# Altium project 2HE2E_Tester.PrjPcb (part 2 of 2)

## Sheet BatteryEmulator.SchDoc
size A4; SheetNumber: 12; SheetTotal: 13
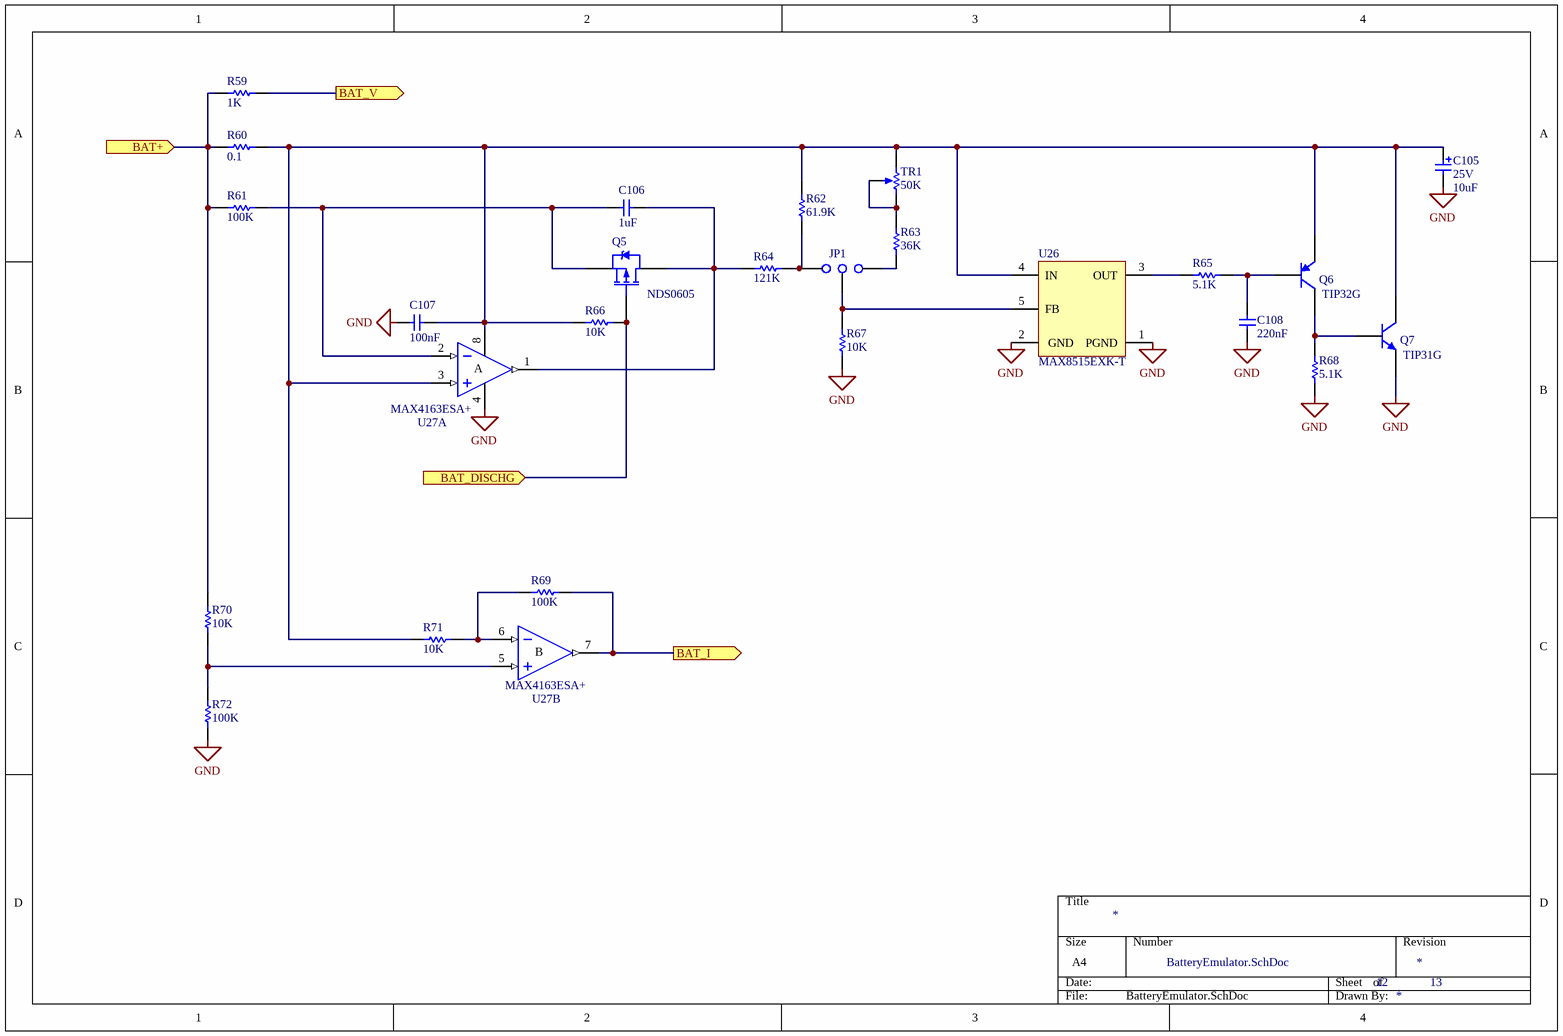
[diagram p12: BatteryEmulator.SchDoc]

### Parts
C105  25V  value 10uF  [Cap Elet SMD 6.3 mm CASE D]
C106  value 1uF  [Cap Polyester 5 mm]  (hidden comment: Cap Polyester)
C107  value 100nF  [0603M-C]  (hidden comment: Cap Ceramic)
C108  value 220nF  [0603M-C]  (hidden comment: Cap Ceramic)
JP1  Jumper 3 pin  [HEADER3]  (value not drawn)
Q5  NDS0605  [SOT23 PMV65XP MOS]
Q6  TIP32G  [TO220_BJT]
Q7  TIP31G  [TO220_BJT]
R59  value 1K  [0603M]  (hidden comment: Resistor)
R60  value 0.1  [1206M]  (hidden comment: Resistor)
R61  value 100K  [0603M]  (hidden comment: Resistor)
R62  value 61.9K  [0603M]  (hidden comment: Resistor)
R63  value 36K  [0603M]  (hidden comment: Resistor)
R64  value 121K  [0603M]  (hidden comment: Resistor)
R65  value 5.1K  [0603M]  (hidden comment: Resistor)
R66  value 10K  [0603M]  (hidden comment: Resistor)
R67  value 10K  [0603M]  (hidden comment: Resistor)
R68  value 5.1K  [0603M]  (hidden comment: Resistor)
R69  value 100K  [0603M]  (hidden comment: Resistor)
R70  value 10K  [0603M]  (hidden comment: Resistor)
R71  value 10K  [0603M]  (hidden comment: Resistor)
R72  value 100K  [0603M]  (hidden comment: Resistor)
TR1  value 50K  [TRIMMER 3296W]  (hidden comment: Giri)
U26  MAX8515EXK-T  [SC70-SOT65P210X110-5N]
U27  MAX4163ESA+  [SOIC127P600-8N]  (parts A,B of 2)

### Ports
BAT+ (in, see 2HE2E_Tester), BAT_DISCHG (in, see 2HE2E_Tester), BAT_I (out, see 2HE2E_Tester), BAT_V (out, see 2HE2E_Tester)

### Nets
GND: C105.2 C107.1 C108.1 Q7.3(E) R67.1 R68.2 R72.1 U26.1(PGND) U26.2(GND) U27.4(V-)
BAT_EMU_DIS: Q5.1(G) R66.2 ; port BAT_DISCHG
BAT_EMU_I: R69.2 U27.7(OUT) ; port BAT_I
BAT_EMU_V: R59.2 ; port BAT_V
NetC105_1: C105.1 C107.2 Q6.3(E) Q7.1(C) R60.2 R62.2 R66.1 R71.1 TR1.1(TOP) U26.4(IN) U27.3(IN+) U27.8(V+)
NetC106_1: C106.1 Q5.3(S) R61.2 U27.2(IN-)
NetC106_2: C106.2 Q5.2(D) R64.1 U27.1(OUT)
NetC108_2: C108.2 Q6.2(B) R65.1
NetJP1_1: JP1.1 R62.1 R64.2
NetJP1_2: JP1.2 R67.2 U26.5(FB)
NetJP1_3: JP1.3 R63.1
NetK1_12: R59.1 R60.1 R61.1 R70.2 ; port BAT+
NetQ6_1: Q6.1(C) Q7.2(B) R68.1
NetR63_2: R63.2 TR1.2(BOT) TR1.3(TAP)
NetR65_2: R65.2 U26.3(OUT)
NetR69_1: R69.1 R71.2 U27.6(IN-)
NetR70_1: R70.1 R72.2 U27.5(IN+)

### Notes on the sheet
- Title
- Size:
- Date:
- A4
- Number:
- Time:
- Revision:
- Sheet
- of
- File:
- (in symbol MAX4163, part A) A
- (in symbol MAX4163, part B) B

### Library data of the parts
C105 = Cap Elettrolitico: Condensatore elettrolitico
C106 = Cap Polyester: Polyester Capacitor
C107 C108 = Cap Ceramic: Ceramic Capacitor
JP1 = Jumper3
Q5 = Transistor PMOS Enhancement: Mosfet canale P Enhancement
Q6 = Transistor PNP: PNP Bipolar Transistor; Published: 8-Jun-2000; LatestRevisionDate: 17-Jul-2002; LatestRevisionNote: Re-released for DXP Platform.; PackageReference: SOT-23B; Publisher: Altium Limited; Code_JEDEC: SOT-23
Q7 = Transistor NPN: NPN Bipolar Transistor
TR1 = Trimmer
U26 = MAX8515: Wide-Input 0.6V Shunt Regulators for Isolated DC-to-DC Converters
U27 = MAX4163: Op Amps UCSP, Micropower, Single-Supply, 10V, Rail-to-Rail I/O

## Sheet BatteryMonitor.SchDoc
size A4; SheetNumber: 13; SheetTotal: 13
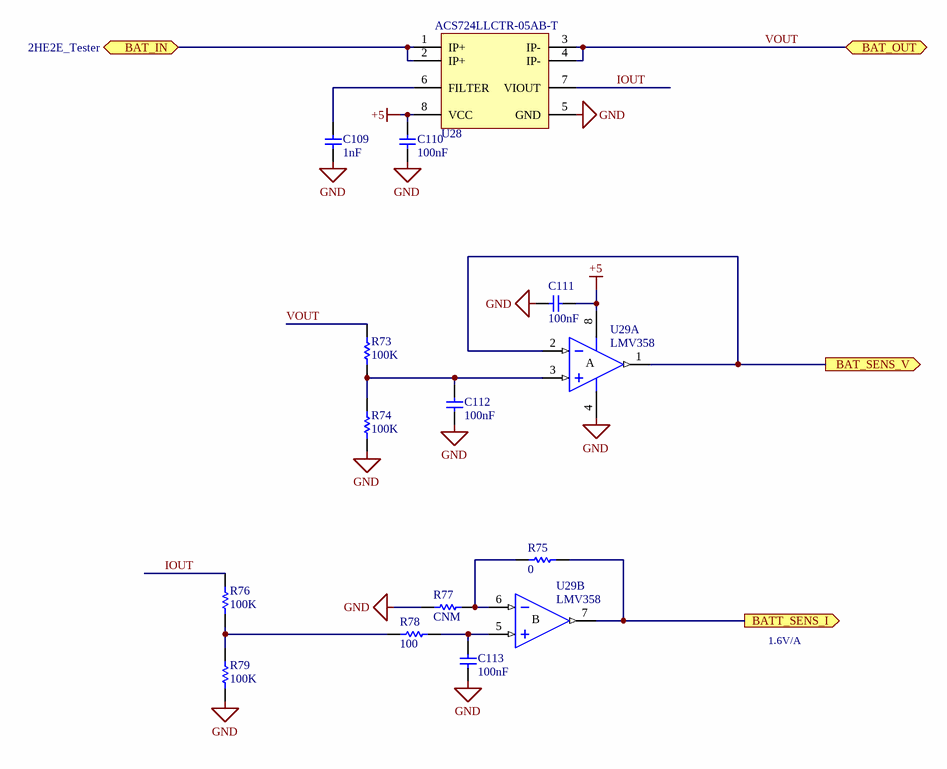
[diagram p13: BatteryMonitor.SchDoc]

### Parts
C109  value 1nF  [0603M]  (hidden comment: Cap Ceramic)
C110  value 100nF  [0603M]  (hidden comment: Cap Ceramic)
C111  value 100nF  [0603M]  (hidden comment: Cap Ceramic)
C112  value 100nF  [0603M]  (hidden comment: Cap Ceramic)
C113  value 100nF  [0603M]  (hidden comment: Cap Ceramic)
R73  value 100K  [0603M]  (hidden comment: Resistor)
R74  value 100K  [0603M]  (hidden comment: Resistor)
R75  value 0  [0603M]  (hidden comment: Resistor)
R76  value 100K  [0603M]  (hidden comment: Resistor)
R77  value CNM  [0603M]  (hidden comment: Resistor)
R78  value 100  [0603M]  (hidden comment: Resistor)
R79  value 100K  [0603M]  (hidden comment: Resistor)
U28  ACS724LLCTR-05AB-T  [SOIC127P600-8N]
U29  LMV358  [SOIC127P600-8N]  (parts A,B of 2)

### Ports
BAT_IN (bidir, see 2HE2E_Tester), BAT_OUT (bidir, see 2HE2E_Tester), BAT_SENS_V (out, see 2HE2E_Tester), BATT_SENS_I (out, see 2HE2E_Tester)

### Nets
+5: C110.2 C111.2 U28.8(VCC) U29.8(V+)
GND: C109.1 C110.1 C111.1 C112.1 C113.1 R74.1 R77.2 R79.2 U28.5(GND) U29.4(GND)
BAT_MON_I: R75.1 U29.7(OUT) ; port BATT_SENS_I
BAT_MON_V: U29.1(OUT) U29.2(IN-) ; port BAT_SENS_V
IOUT: R76.1 U28.7(VIOUT)
VOUT: R73.2 U28.3(IP-) U28.4(IP-) ; port BAT_OUT
NetC109_2: C109.2 U28.6(FILTER)
NetC112_2: C112.2 R73.1 R74.2 U29.3(IN+)
NetC113_2: C113.2 R78.1 U29.5(IN+)
NetJ13_1: U28.1(IP+) U28.2(IP+) ; port BAT_IN
NetR75_2: R75.2 R77.1 U29.6(IN-)
NetR76_2: R76.2 R78.2 R79.1

### Notes on the sheet
- 1.6V/A
- Title
- Size:
- Date:
- A4
- Number:
- Time:
- Revision:
- Sheet
- of
- File:
- (in symbol LMV358, part A) A
- (in symbol LMV358, part B) B

### Library data of the parts
C109-C113 = Cap Ceramic: Ceramic Capacitor 25V
U28 = ACS724LLCTR-xxxx: Automotive-Grade, Galvanically Isolated Current Sensor IC with Common-Mode Field Rejection
U29 = LMV358: Dual Operational Amplifier Single Supply Rail to Rail; DatasheetDocument: Jan-1999; PackageDocument: Jul-1998; Publisher: Altium Limited; Code_JEDEC: MS-012-AA; Code_IPC: SO8; ComponentLink1Description: Manufacturer Link; ComponentLink1URL: http://www.st.com/; ComponentLink2Description: Datasheet; ComponentLink2URL: http://www.st.com/stonline/products/literature/ds/2300/tl082.pdf

## Nets that join several sheets
+3.3: 2HE2E_Tester (18 pins), RS485-Test (C33.1 U11.8), U_CAN_IF0_Test (C40_1.2 U12_1.5), U_CAN_IF1_Test (C40_2.2 U12_2.5), GPO_IF (6 pins), REL_IF (R21.1 R22.1 R27.1 R28.1), U_CAN0_Switch (R44_1.2), U_CAN1_Switch (R44_2.2), R7FA4M3AF3CFB (L2.1 L3.1)
+5: 2HE2E_Tester (6 pins), U_CAN_IF0_Test (C39_1.2 U12_1.3), U_CAN_IF1_Test (C39_2.2 U12_2.3), DCDC_AP62600_5V (5 pins), U_CAN0_Switch (C43_1.2 U14_1.14), U_CAN1_Switch (C43_2.2 U14_2.14), R7FA4M3AF3CFB (R18.2), Raspberry_Pwr (11 pins), 2HBM2_Pwr (13 pins), BatteryMonitor (C110.2 C111.2 U28.8 U29.8)
+12: 2HE2E_Tester (C17.1 D4.2 K1.1 M1.1), GPI_IF (6 pins), DCDC_AP62600_5V (C27.2 R16.1 U10.2), U_CAN0_Switch (C41_1.1 U13_1.1), U_CAN1_Switch (C41_2.1 U13_2.1), Raspberry_Pwr (8 pins), 2HBM2_Pwr (8 pins)
GND: 2HE2E_Tester (76 pins), RS485-Test (C33.2 U11.5), U_CAN_IF0_Test (7 pins), U_CAN_IF1_Test (7 pins), GPO_IF (6 pins), REL_IF (8 pins), GPI_IF (12 pins), DCDC_AP62600_5V (11 pins), U_CAN0_Switch (7 pins), U_CAN1_Switch (7 pins), R7FA4M3AF3CFB (33 pins), Raspberry_Pwr (33 pins), 2HBM2_Pwr (39 pins), BatteryEmulator (10 pins), BatteryMonitor (10 pins)
VOUT_2H: 2HE2E_Tester (J6.1 J6.2), 2HBM2_Pwr (R52.2 U22.3 U22.4)
VOUT_RP: 2HE2E_Tester (C1.1 C2.1 U1.2 U1.4), Raspberry_Pwr (8 pins)
2HBM2_DISB: R7FA4M3AF3CFB (U16.63), 2HBM2_Pwr (U25.1)
2HBM2_IOUT: R7FA4M3AF3CFB (U16.135), 2HBM2_Pwr (R54.1 U24.7)
2HBM2_PWM: R7FA4M3AF3CFB (U16.64), 2HBM2_Pwr (U23.1)
2HBM2_VOUT: R7FA4M3AF3CFB (U16.136), 2HBM2_Pwr (U24.1 U24.2)
AIN_GPO1: GPO_IF (5 pins), R7FA4M3AF3CFB (U16.140)
AIN_GPO2: GPO_IF (5 pins), R7FA4M3AF3CFB (U16.139)
AIN_GPO3: GPO_IF (5 pins), R7FA4M3AF3CFB (U16.138)
ANT_GPS: 2HE2E_Tester (R10.2 U30.4), R7FA4M3AF3CFB (U16.51)
ANT_LTE_DIV: 2HE2E_Tester (R7.2 U3.4), R7FA4M3AF3CFB (U16.52)
ANT_LTE_MAIN: 2HE2E_Tester (R4.2 U2.4), R7FA4M3AF3CFB (U16.53)
BAT_EMU_DIS: R7FA4M3AF3CFB (U16.89), BatteryEmulator (Q5.1 R66.2)
BAT_EMU_I: R7FA4M3AF3CFB (U16.123), BatteryEmulator (R69.2 U27.7)
BAT_EMU_V: R7FA4M3AF3CFB (U16.124), BatteryEmulator (R59.2)
BAT_EN_MON: 2HE2E_Tester (R6.1 R8.1), R7FA4M3AF3CFB (U16.87)
BAT_MON_I: R7FA4M3AF3CFB (U16.131), BatteryMonitor (R75.1 U29.7)
BAT_MON_V: R7FA4M3AF3CFB (U16.132), BatteryMonitor (U29.1 U29.2)
BS_DEBUG_RX: 2HE2E_Tester (J5.10), R7FA4M3AF3CFB (U16.26)
BS_DEBUG_TX: 2HE2E_Tester (J5.12), R7FA4M3AF3CFB (U16.27)
BTN_DOWN: 2HE2E_Tester (SW2.1), R7FA4M3AF3CFB (U16.9)
BTN_ESC: 2HE2E_Tester (SW6.1), R7FA4M3AF3CFB (U16.13)
BTN_LEFT: 2HE2E_Tester (SW3.1), R7FA4M3AF3CFB (U16.10)
BTN_OK: 2HE2E_Tester (SW5.1), R7FA4M3AF3CFB (U16.12)
BTN_RIGHT: 2HE2E_Tester (SW4.1), R7FA4M3AF3CFB (U16.11)
BTN_UP: 2HE2E_Tester (SW1.1), R7FA4M3AF3CFB (U16.8)
CAN0_RX: U_CAN_IF0_Test (U12_1.4), R7FA4M3AF3CFB (U16.3)
CAN0_TX: U_CAN_IF0_Test (U12_1.1), R7FA4M3AF3CFB (U16.2)
CAN1_RX: U_CAN_IF1_Test (U12_2.4), R7FA4M3AF3CFB (U16.143)
CAN1_TX: U_CAN_IF1_Test (U12_2.1), R7FA4M3AF3CFB (U16.144)
CAN_12V_0: U_CAN0_Switch (R43_1.2 U13_1.3), R7FA4M3AF3CFB (U16.96)
CAN_12V_1: U_CAN1_Switch (R43_2.2 U13_2.3), R7FA4M3AF3CFB (U16.84)
CAN_GND_0: U_CAN0_Switch (U14_1.6), R7FA4M3AF3CFB (U16.95)
CAN_GND_1: U_CAN1_Switch (U14_2.6), R7FA4M3AF3CFB (U16.85)
CAN_H_ON_0: U_CAN0_Switch (U14_1.13), R7FA4M3AF3CFB (U16.98)
CAN_H_ON_1: U_CAN1_Switch (U14_2.13), R7FA4M3AF3CFB (U16.93)
CAN_L_ON_0: U_CAN0_Switch (U14_1.5), R7FA4M3AF3CFB (U16.97)
CAN_L_ON_1: U_CAN1_Switch (U14_2.5), R7FA4M3AF3CFB (U16.83)
CAN_REL_0: U_CAN0_Switch (U15_1.2), R7FA4M3AF3CFB (U16.94)
CAN_REL_1: U_CAN1_Switch (U15_2.2), R7FA4M3AF3CFB (U16.86)
DISP_SCL: 2HE2E_Tester (J3.3 R2.1), R7FA4M3AF3CFB (U16.42)
DISP_SDA: 2HE2E_Tester (J3.4 R1.1), R7FA4M3AF3CFB (U16.43)
GPI1: 2HE2E_Tester (J7.11), GPI_IF (U7.5 U7.6)
GPI2: 2HE2E_Tester (J7.12), GPI_IF (U8.5 U8.6)
GPI3: 2HE2E_Tester (J7.13), GPI_IF (U9.5 U9.6)
GPO1: 2HE2E_Tester (J7.4), GPO_IF (R34.1)
GPO2: 2HE2E_Tester (J7.5), GPO_IF (R37.1)
GPO3: 2HE2E_Tester (J7.6), GPO_IF (R40.1)
HW_DEBUG_RX: 2HE2E_Tester (J5.9), R7FA4M3AF3CFB (U16.34)
HW_DEBUG_TX: 2HE2E_Tester (J5.11), R7FA4M3AF3CFB (U16.35)
NetC37_1_2: U_CAN_IF0_Test (C37_1.2 U12_1.6), U_CAN0_Switch (U14_1.4)
NetC37_2_2: U_CAN_IF1_Test (C37_2.2 U12_2.6), U_CAN1_Switch (U14_2.4)
NetC38_1_2: U_CAN_IF0_Test (C38_1.2 U12_1.7), U_CAN0_Switch (U14_1.2)
NetC38_2_2: U_CAN_IF1_Test (C38_2.2 U12_2.7), U_CAN1_Switch (U14_2.2)
NetJ13_1: 2HE2E_Tester (J13.1), BatteryMonitor (U28.1 U28.2)
NetK1_12: 2HE2E_Tester (K1.12), BatteryEmulator (R59.1 R60.1 R61.1 R70.2)
~{RESET}: 2HE2E_Tester (J2.7), R7FA4M3AF3CFB (R46.2 U16.55)
RASP_DISB: R7FA4M3AF3CFB (U16.60), Raspberry_Pwr (U20.1)
RASP_EVENT_IN: 2HE2E_Tester (U1.29), R7FA4M3AF3CFB (U16.23)
RASP_EVENT_OUT: 2HE2E_Tester (U1.31), R7FA4M3AF3CFB (U16.22)
RASP_PWM: R7FA4M3AF3CFB (U16.61), Raspberry_Pwr (U18.1)
RASP_RX: 2HE2E_Tester (U1.8), R7FA4M3AF3CFB (U16.108)
RASP_TX: 2HE2E_Tester (U1.10), R7FA4M3AF3CFB (U16.107)
RASP_VOUT: R7FA4M3AF3CFB (U16.137), Raspberry_Pwr (U19.1 U19.2)
REL1: 2HE2E_Tester (J6.19), REL_IF (R23.1)
REL2: 2HE2E_Tester (J6.20), REL_IF (R24.1)
REL3: 2HE2E_Tester (J6.21), REL_IF (R29.1)
REL4: 2HE2E_Tester (J6.22), REL_IF (R30.1)
REL_IN_1: REL_IF (Q1.1 R21.2), R7FA4M3AF3CFB (U16.4)
REL_IN_2: REL_IF (Q2.1 R22.2), R7FA4M3AF3CFB (U16.5)
REL_IN_3: REL_IF (Q3.1 R27.2), R7FA4M3AF3CFB (U16.6)
REL_IN_4: REL_IF (Q4.1 R28.2), R7FA4M3AF3CFB (U16.7)
SWDCLK: 2HE2E_Tester (J2.3), R7FA4M3AF3CFB (U16.72)
SWDIO: 2HE2E_Tester (J2.5), R7FA4M3AF3CFB (U16.73)
TEST_485_A: 2HE2E_Tester (J7.10), RS485-Test (U11.6)
TEST_485_B: 2HE2E_Tester (J7.3), RS485-Test (U11.7)
TEST_485_DIR: RS485-Test (U11.2 U11.3), R7FA4M3AF3CFB (U16.76)
TEST_485_RX: RS485-Test (U11.1), R7FA4M3AF3CFB (U16.78)
TEST_485_TX: RS485-Test (U11.4), R7FA4M3AF3CFB (U16.77)
TEST_CAN0_H: 2HE2E_Tester (J6.15), U_CAN0_Switch (5 pins)
TEST_CAN0_L: 2HE2E_Tester (J6.3), U_CAN0_Switch (R45_1.1 U14_1.3 U14_1.8 U15_1.3)
TEST_CAN1_H: 2HE2E_Tester (J6.17), U_CAN1_Switch (5 pins)
TEST_CAN1_L: 2HE2E_Tester (J6.5), U_CAN1_Switch (R45_2.1 U14_2.3 U14_2.8 U15_2.3)
USB_DATA_EN: 2HE2E_Tester (R12.2 U5.9), R7FA4M3AF3CFB (U16.70)
USB_VBUS_EN: 2HE2E_Tester (R11.2 U4.3), R7FA4M3AF3CFB (U16.71)
VOUT: 2HE2E_Tester (K1.10), BatteryMonitor (R73.2 U28.3 U28.4)